# EAGLE schematic module-sip (EAGLE 9.6.2)

## Sheet 1 of 4

## Sheet 2 of 4
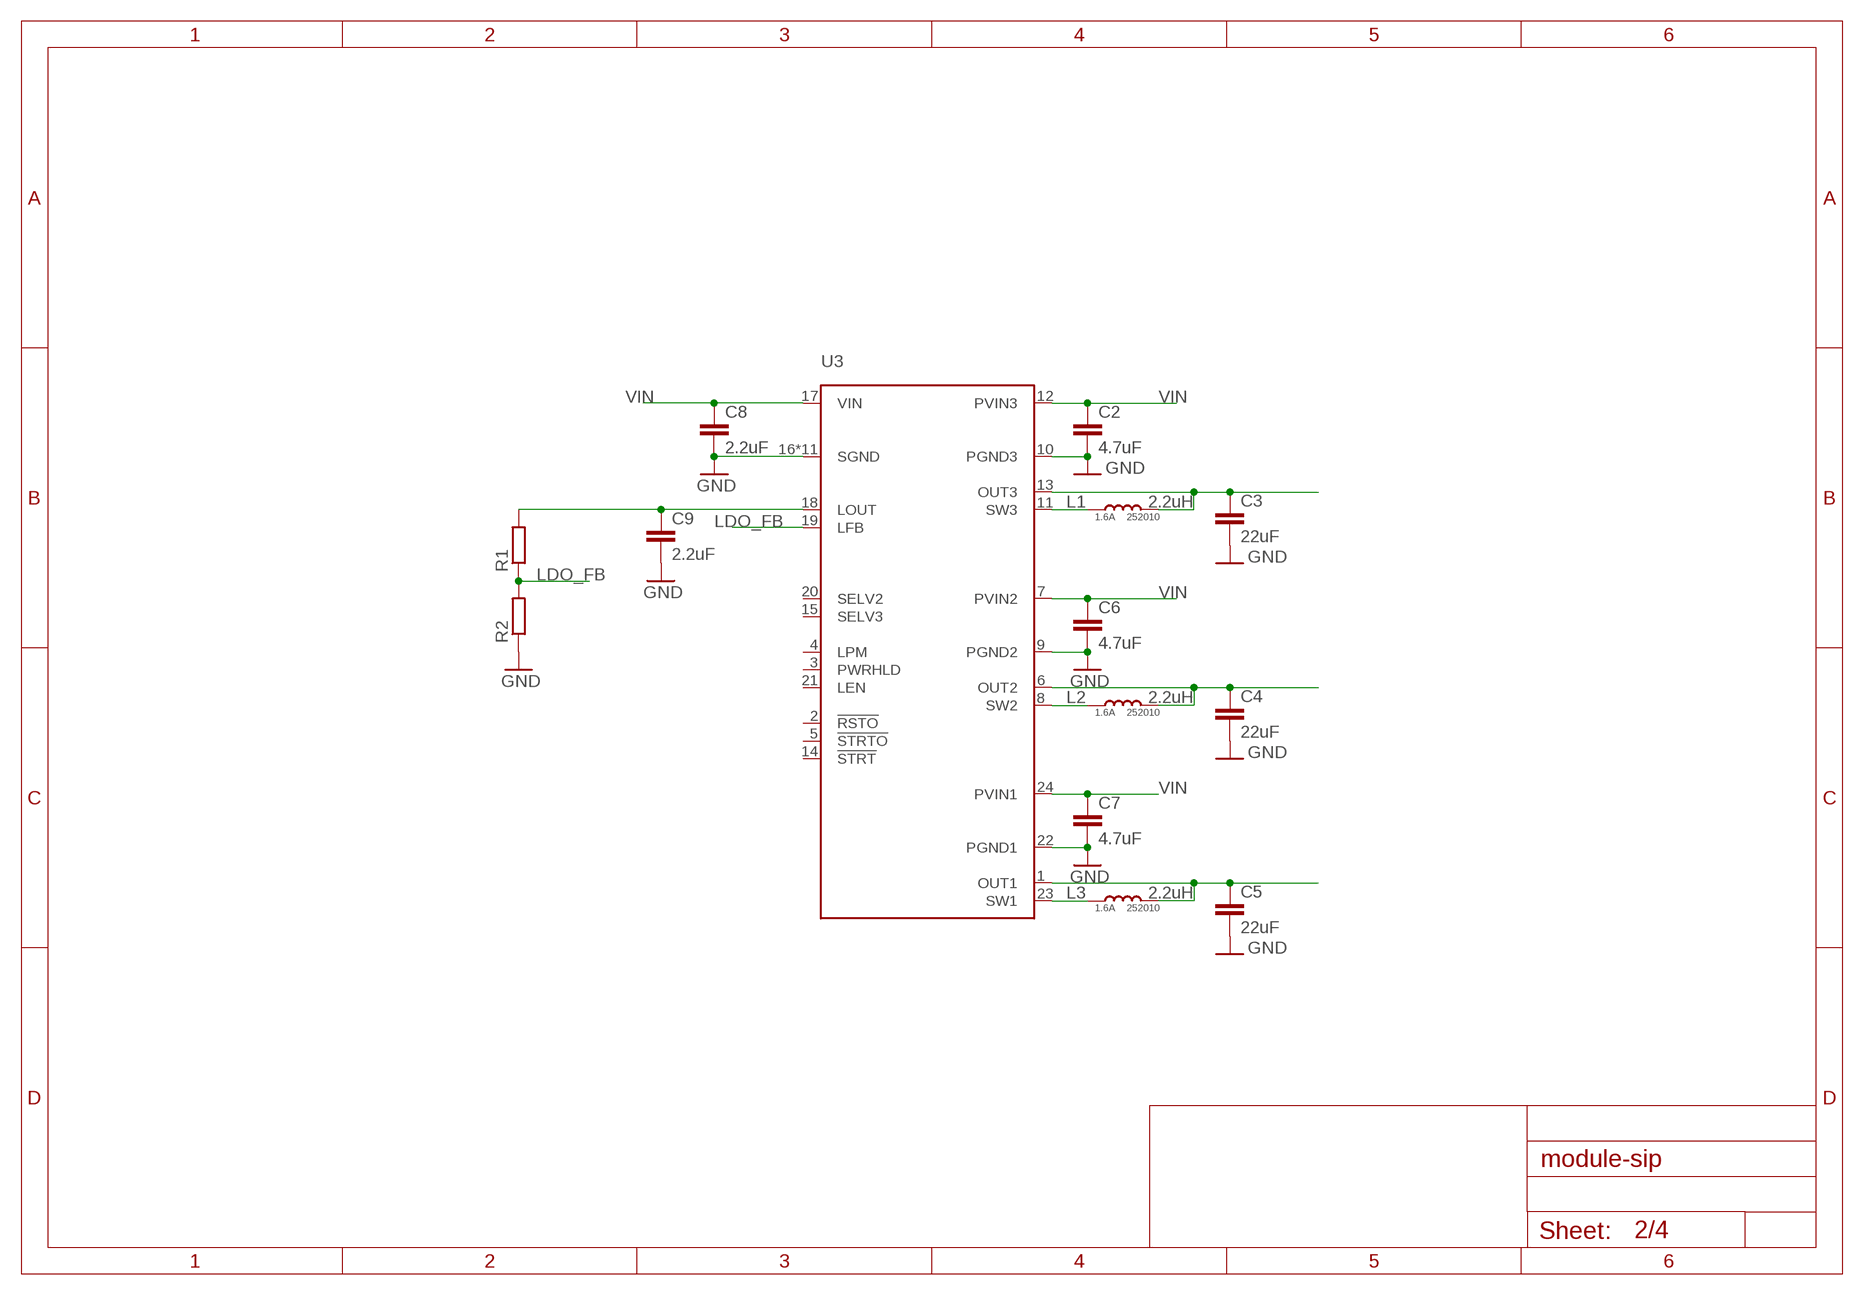
[diagram p0: schematic, sheet 2]

### Parts
C2  4.7uF  C-EUC0603  [C0603]
C3  22uF  C-EUC0805  [C0805]
C4  22uF  C-EUC0805  [C0805]
C5  22uF  C-EUC0805  [C0805]
C6  4.7uF  C-EUC0603  [C0603]
C7  4.7uF  C-EUC0603  [C0603]
C8  2.2uF  C-EUC0603  [C0603]
C9  2.2uF  C-EUC0603  [C0603]
L1  2.2uH  TYA2520102R2M-10  [INDUCTOR2520]
L2  2.2uH  TYA2520102R2M-10  [INDUCTOR2520]
L3  2.2uH  TYA2520102R2M-10  [INDUCTOR2520]
R1  R-EU_R0402  [R0402]
R2  R-EU_R0402  [R0402]
U3  MCP16501  [QFN50P400X400X90-25T270N]

### Nets
GND: C2.2 C3.2 C4.2 C5.2 C6.2 C7.2 C8.2 C9.2 R2.1 U3.9(PGND2) U3.10(PGND3) U3.16(SGND) U3.22(PGND1) U3.25(SGND) U3.P$1(SGND) U3.P$2(SGND) U3.P$3(SGND) U3.P$4(SGND) U3.P$5(SGND) U3.P$6(SGND) U3.P$7(SGND) U3.P$8(SGND) U3.P$9(SGND)
LDO_FB: R1.1 R2.2 U3.19(LFB)
N$7: L1.P$1 U3.11(SW3)
N$8: C3.1 L1.P$2 U3.13(OUT3)
N$10: L2.P$1 U3.8(SW2)
N$11: L3.P$1 U3.23(SW1)
N$12: C5.1 L3.P$2 U3.1(OUT1)
N$13: C4.1 L2.P$2 U3.6(OUT2)
N$14: C9.1 R1.2 U3.18(LOUT)
VIN: C2.1 C6.1 C7.1 C8.1 U3.7(PVIN2) U3.12(PVIN3) U3.17(VIN) U3.24(PVIN1)
Unconnected: U3.2(!RSTO) U3.3(PWRHLD) U3.4(LPM) U3.5(!STRTO) U3.14(!STRT) U3.15(SELV3) U3.20(SELV2) U3.21(LEN)

## Sheet 3 of 4
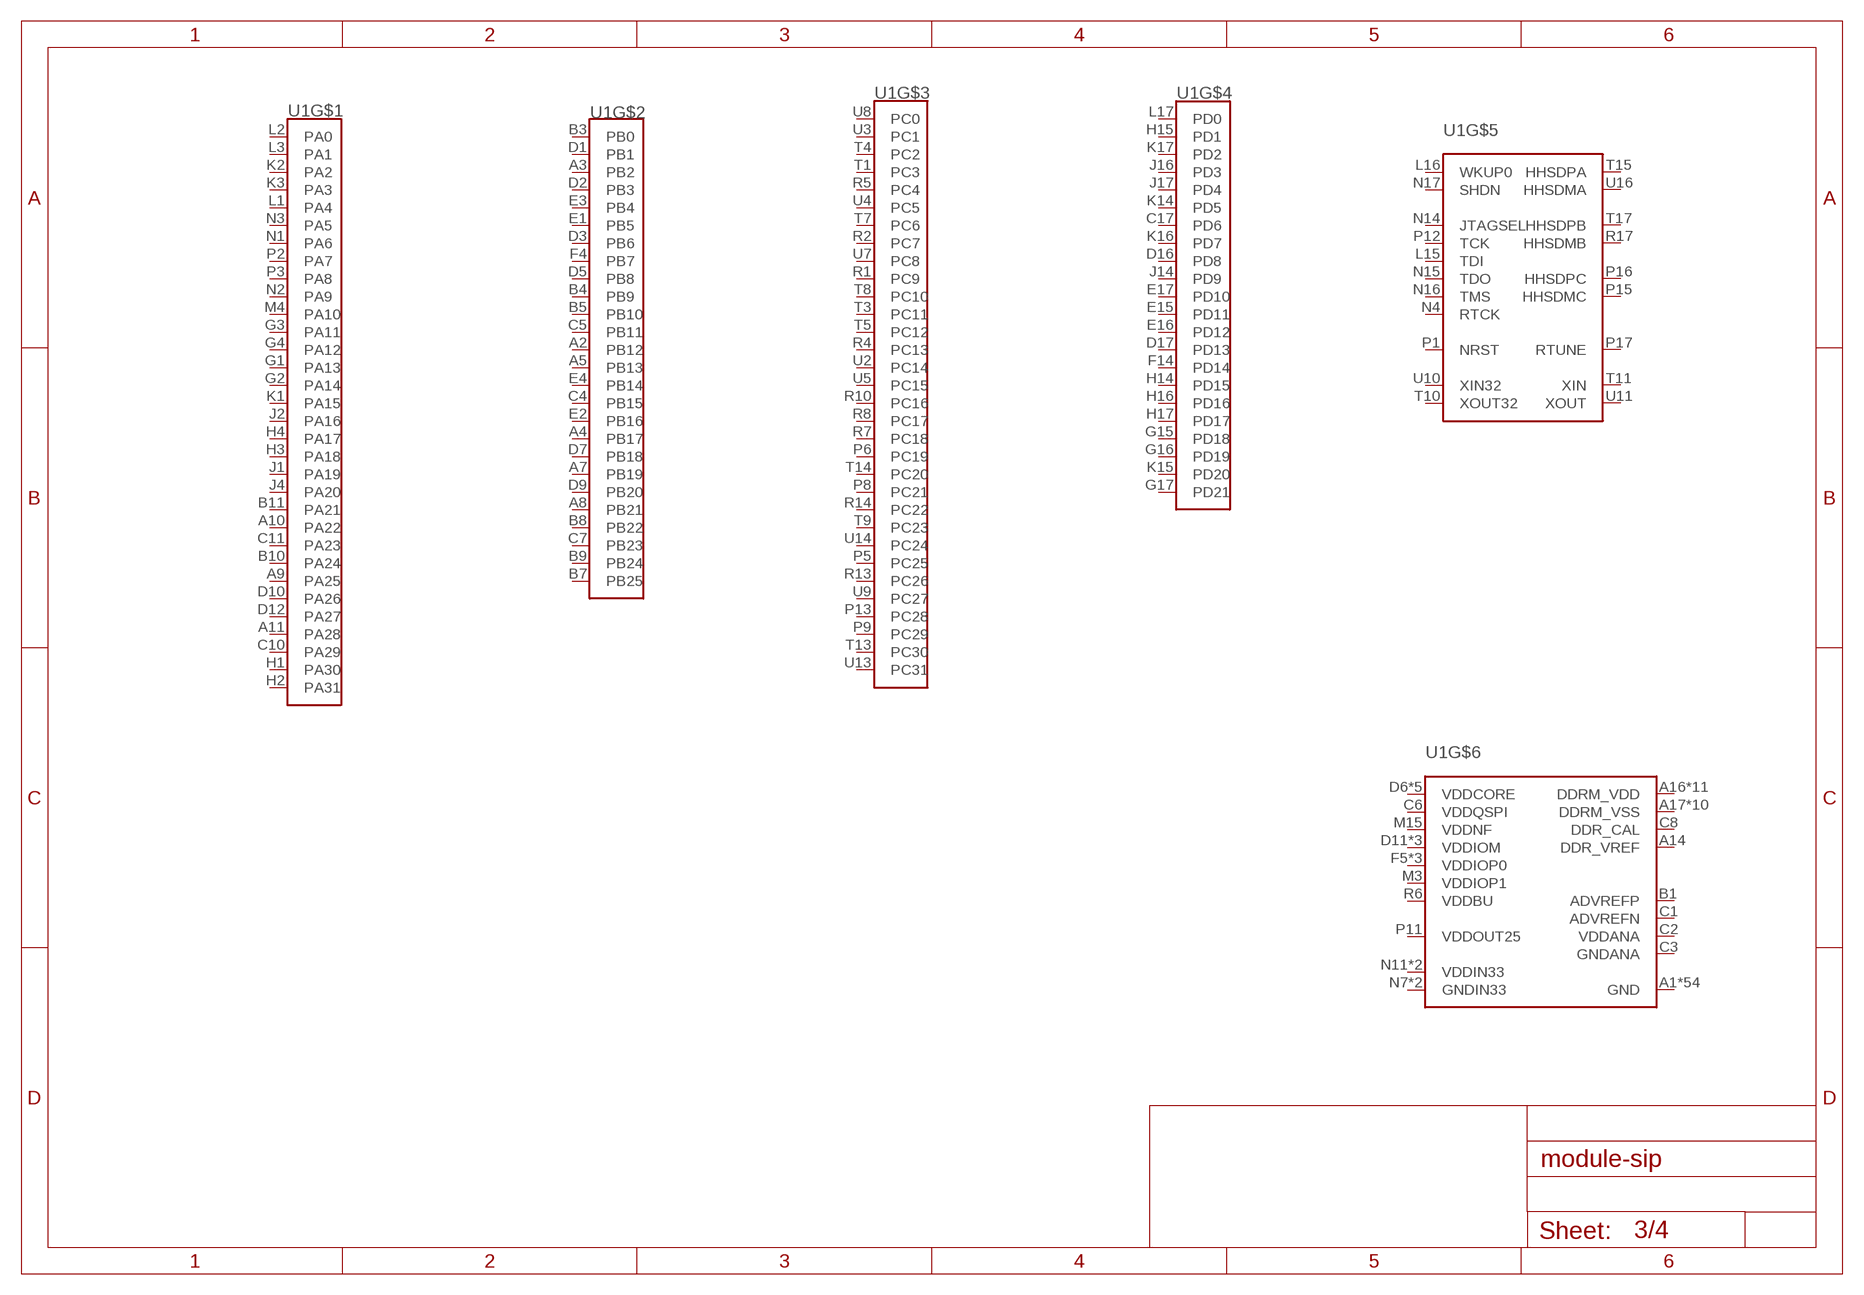
[diagram p1: schematic, sheet 3]

### Parts
U1  SAM9X60-D1G  [BGA289C80P17X17_1400X1400X120N]
Unconnected: U1.A1(GND) U1.A2(PB12) U1.A3(PB2) U1.A4(PB17) U1.A5(PB13) U1.A7(PB19) U1.A8(PB21) U1.A9(PA25) U1.A10(PA22) U1.A11(PA28) U1.A13(GND) U1.A14(DDR_VREF) U1.A15(GND) U1.A16(DDRM_VDD) U1.A17(DDRM_VSS) U1.B1(ADVREFP) U1.B2(GND) U1.B3(PB0) U1.B4(PB9) U1.B5(PB10) U1.B7(PB25) U1.B8(PB22) U1.B9(PB24) U1.B10(PA24) U1.B11(PA21) U1.B13(GND) U1.B14(GND) U1.B15(DDRM_VDD) U1.B16(DDRM_VSS) U1.B17(DDRM_VDD) U1.C1(ADVREFN) U1.C2(VDDANA) U1.C3(GNDANA) U1.C4(PB15) U1.C5(PB11) U1.C6(VDDQSPI) U1.C7(PB23) U1.C8(DDR_CAL) U1.C9(GND) U1.C10(PA29) U1.C11(PA23) U1.C12(DDRM_VSS) U1.C13(GND) U1.C14(DDRM_VDD) U1.C15(DDRM_VSS) U1.C16(DDRM_VDD) U1.C17(PD6) U1.D1(PB1) U1.D2(PB3) U1.D3(PB6) U1.D4(GND) U1.D5(PB8) U1.D6(VDDCORE) U1.D7(PB18) U1.D8(VDDCORE) U1.D9(PB20) U1.D10(PA26) U1.D11(VDDIOM) U1.D12(PA27) U1.D13(DDRM_VDD) U1.D14(DDRM_VSS) U1.D15(DDRM_VDD) U1.D16(PD8) U1.D17(PD13) U1.E1(PB5) U1.E2(PB16) U1.E3(PB4) U1.E4(PB14) U1.E5(GND) U1.E6(GND) U1.E7(GND) U1.E11(DDRM_VDD) U1.E12(DDRM_VDD) U1.E13(DDRM_VSS) U1.E14(VDDIOM) U1.E15(PD11) U1.E16(PD12) U1.E17(PD10) U1.F3(GND) U1.F4(PB7) U1.F5(VDDIOP0) U1.F6(GND) U1.F7(GND) U1.F11(DDRM_VSS) U1.F12(DDRM_VSS) U1.F13(DDRM_VDD) U1.F14(PD14) U1.F15(DDRM_VSS) U1.G1(PA13) U1.G2(PA14) U1.G3(PA11) U1.G4(PA12) U1.G5(VDDCORE) U1.G6(GND) U1.G12(DDRM_VSS) U1.G13(DDRM_VDD) U1.G14(VDDIOM) U1.G15(PD18) U1.G16(PD19) U1.G17(PD21) U1.H1(PA30) U1.H2(PA31) U1.H3(PA18) U1.H4(PA17) U1.H8(GND) U1.H9(GND) U1.H10(GND) U1.H14(PD15) U1.H15(PD1) U1.H16(PD16) U1.H17(PD17) U1.J1(PA19) U1.J2(PA16) U1.J3(GND) U1.J4(PA20) U1.J8(GND) U1.J9(GND) U1.J10(GND) U1.J14(PD9) U1.J15(GND) U1.J16(PD3) U1.J17(PD4) U1.K1(PA15) U1.K2(PA2) U1.K3(PA3) U1.K4(VDDIOP0) U1.K8(GND) U1.K9(GND) U1.K10(GND) U1.K14(PD5) U1.K15(PD20) U1.K16(PD7) U1.K17(PD2) U1.L1(PA4) U1.L2(PA0) U1.L3(PA1) U1.L4(VDDIOP0) U1.L5(GND) U1.L6(VDDCORE) U1.L12(GND) U1.L13(GND) U1.L14(GND) U1.L15(TDI) U1.L16(WKUP0) U1.L17(PD0) U1.M3(VDDIOP1) U1.M4(PA10) U1.M5(GND) U1.M6(GND) U1.M7(VDDCORE) U1.M11(GND) U1.M12(GND) U1.M13(GND) U1.M14(GND) U1.M15(VDDNF) U1.N1(PA6) U1.N2(PA9) U1.N3(PA5) U1.N4(RTCK) U1.N5(GND) U1.N6(GND) U1.N7(GNDIN33) U1.N11(VDDIN33) U1.N12(GND) U1.N13(GND) U1.N14(JTAGSEL) U1.N15(TDO) U1.N16(TMS) U1.N17(SHDN) U1.P1(NRST) U1.P2(PA7) U1.P3(PA8) U1.P4(GND) U1.P5(PC25) U1.P6(PC19) U1.P7(GNDIN33) U1.P8(PC21) U1.P9(PC29) U1.P10(GND) U1.P11(VDDOUT25) U1.P12(TCK) U1.P13(PC28) U1.P14(GND) U1.P15(HHSDMC) U1.P16(HHSDPC) U1.P17(RTUNE) U1.R1(PC9) U1.R2(PC7) U1.R3(GND) U1.R4(PC13) U1.R5(PC4) U1.R6(VDDBU) U1.R7(PC18) U1.R8(PC17) U1.R9(GND) U1.R10(PC16) U1.R11(GND) U1.R12(VDDIN33) U1.R13(PC26) U1.R14(PC22) U1.R15(GND) U1.R16(GND) U1.R17(HHSDMB) U1.T1(PC3) U1.T2(GND) U1.T3(PC11) U1.T4(PC2) U1.T5(PC12) U1.T7(PC6) U1.T8(PC10) U1.T9(PC23) U1.T10(XOUT32) U1.T11(XIN) U1.T13(PC30) U1.T14(PC20) U1.T15(HHSDPA) U1.T16(GND) U1.T17(HHSDPB) U1.U1(GND) U1.U2(PC14) U1.U3(PC1) U1.U4(PC5) U1.U5(PC15) U1.U7(PC8) U1.U8(PC0) U1.U9(PC27) U1.U10(XIN32) U1.U11(XOUT) U1.U13(PC31) U1.U14(PC24) U1.U15(GND) U1.U16(HHSDMA) U1.U17(GND)

## Sheet 4 of 4
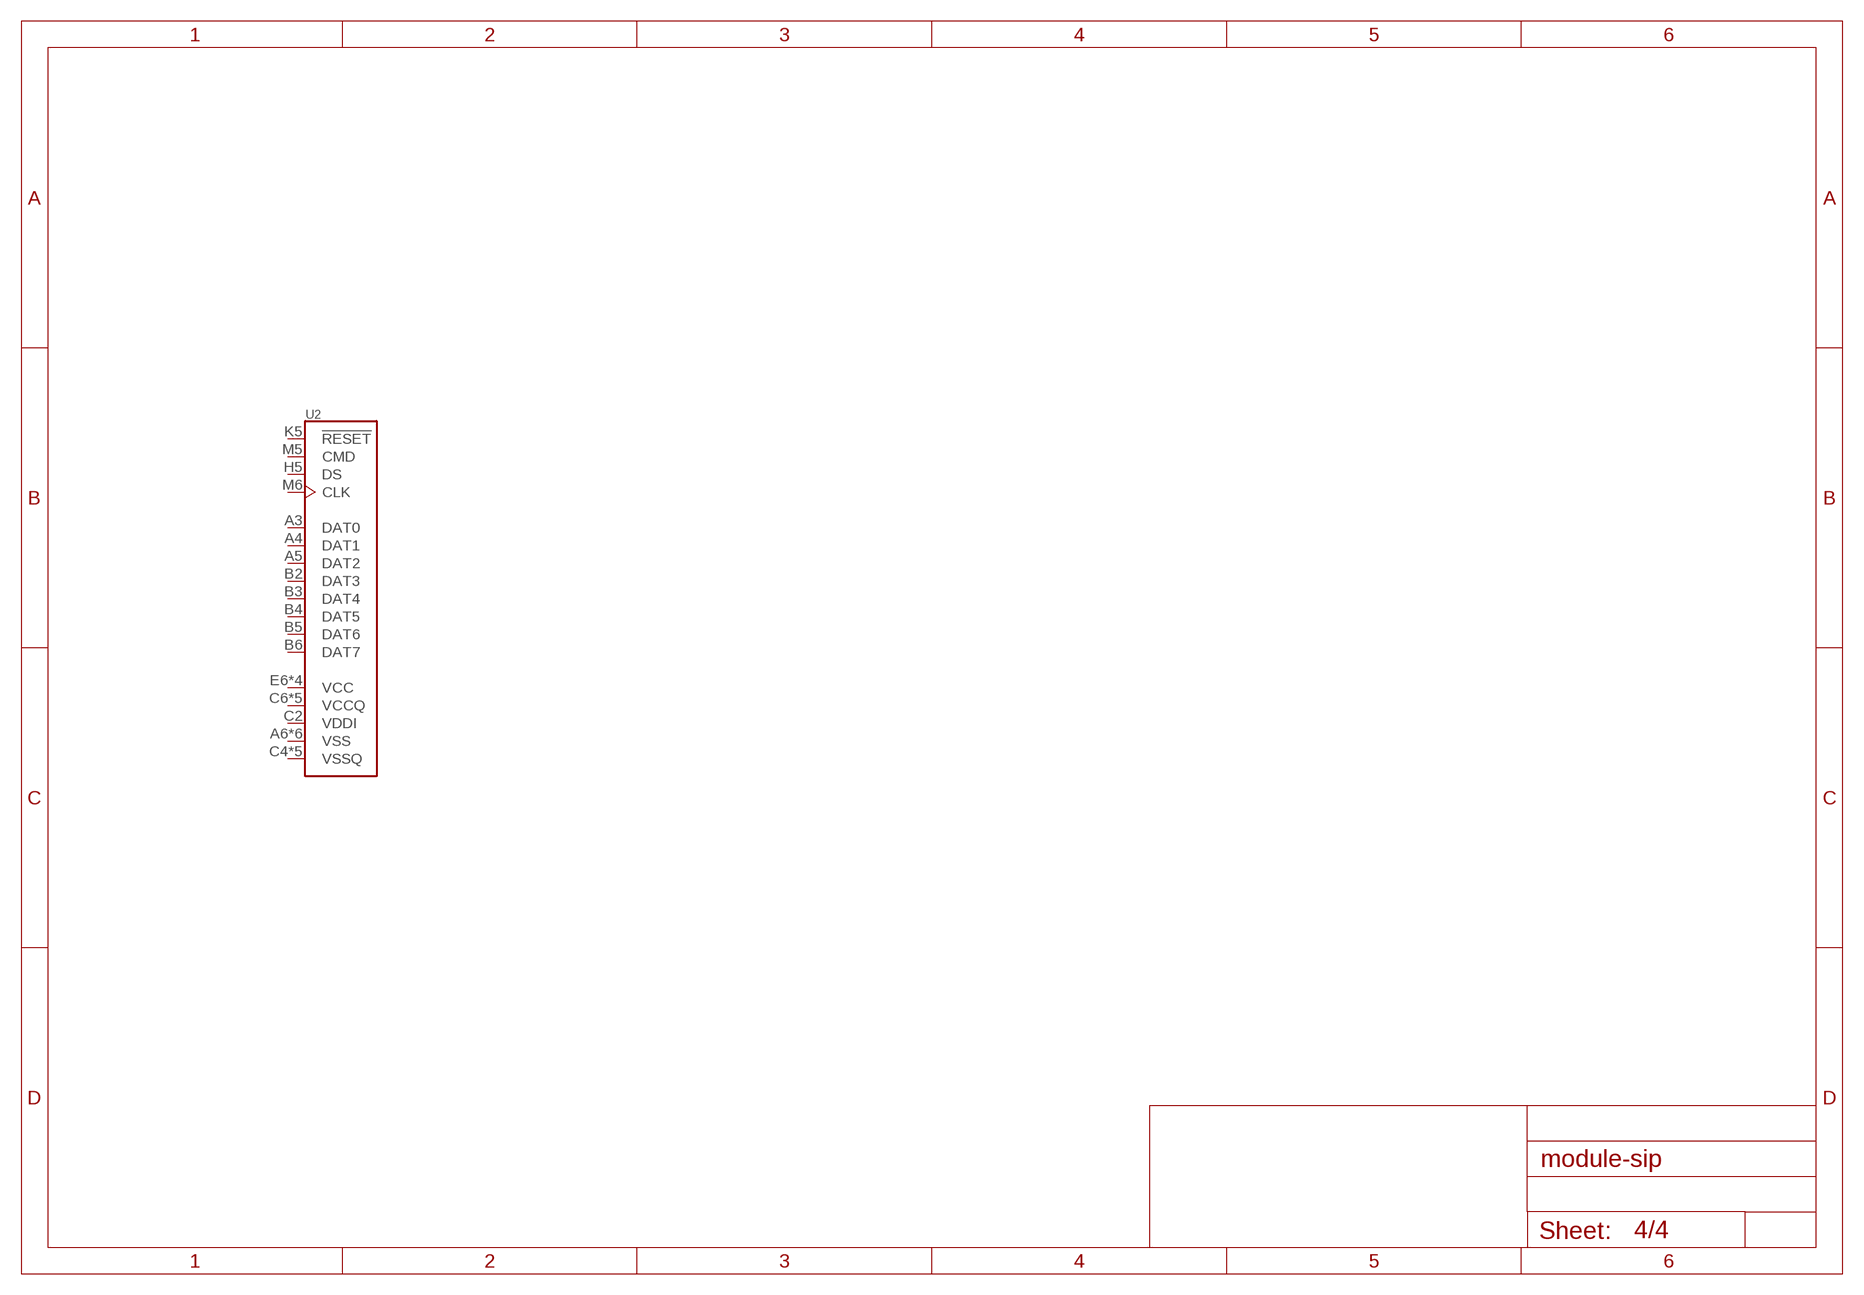
[diagram p2: schematic, sheet 4]

### Parts
U2  THGBMNG5D1LBAIL  [BGA153C50P14X14_1300X1150X100N]
Unconnected: U2.A3(DAT0) U2.A4(DAT1) U2.A5(DAT2) U2.A6(VSS) U2.B2(DAT3) U2.B3(DAT4) U2.B4(DAT5) U2.B5(DAT6) U2.B6(DAT7) U2.C2(VDDI) U2.C4(VSSQ) U2.C6(VCCQ) U2.E6(VCC) U2.E7(VSS) U2.F5(VCC) U2.G5(VSS) U2.H5(DS) U2.H10(VSS) U2.J5(VSS) U2.J10(VCC) U2.K5(!RESET) U2.K8(VSS) U2.K9(VCC) U2.M4(VCCQ) U2.M5(CMD) U2.M6(CLK) U2.N2(VSSQ) U2.N4(VCCQ) U2.N5(VSSQ) U2.P3(VCCQ) U2.P4(VSSQ) U2.P5(VCCQ) U2.P6(VSSQ)

## Library data of the parts
C2-C9 = rcl:C-EU: CAPACITOR, European symbol; SPICEPREFIX: C
L1-L3 = parts-laird:TYA252010; CURRENT: 1.6A; PACKAGE: 252010
R1 R2 = rcl:R-EU_: RESISTOR, European symbol; SPICEPREFIX: R
U1 = parts-microchip:SAM9X60-
U2 = parts-toshiba:THGBMNG5D1LBAIL
U3 = parts-microchip:MCP16501